# EAGLE design connectors (EAGLE 7.2.0)
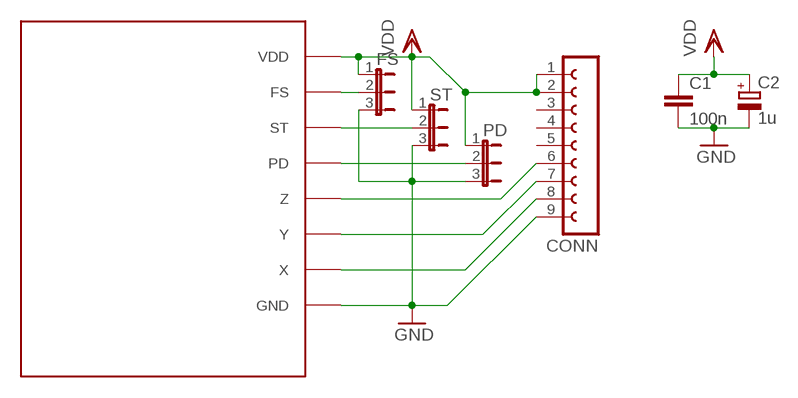
[diagram p0: schematic, sheet 1]

## Parts
C1  100n  C-EU050-025X075  [C050-025X075]
C2  1u  CPOL-EUE2-5  [E2-5]
CONN  FE09-1  [FE09]
FS  JP2E  [JP2]
PD  JP2E  [JP2]
ST  JP2E  [JP2]
U$2  LIS  [LIS344]

## Nets
GND: C1.2 C2.- CONN.9 FS.3 PD.3 ST.3 U$2.GND1(GND) U$2.GND2(GND) U$2.GND3(GND) U$2.GND5(GND)
N$1: CONN.8 U$2.X
N$2: FS.2 U$2.FS
N$3: CONN.7 U$2.Y
N$4: CONN.6 U$2.Z
N$5: ST.2 U$2.ST
N$6: PD.2 U$2.PD
VDD: C1.1 C2.+ CONN.1 CONN.2 FS.1 PD.1 ST.1 U$2.VDD U$2.VDD2(VDD)
Unconnected: CONN.3 CONN.4 CONN.5

## Library data of the parts
C1 = rcl:C-EU: CAPACITOR, European symbol
C2 = rcl:CPOL-EU: POLARIZED CAPACITOR, European symbol
CONN = con-lsta:FE09-1: FEMALE HEADER; OC_FARNELL: unknown; OC_NEWARK: unknown
FS PD ST = jumper:JP2E: JUMPER
U$2 = TIStellarisLaunchpad:LIS

## Net classes
2 power: width 0.508 mm, clearance 0.203 mm

## Board
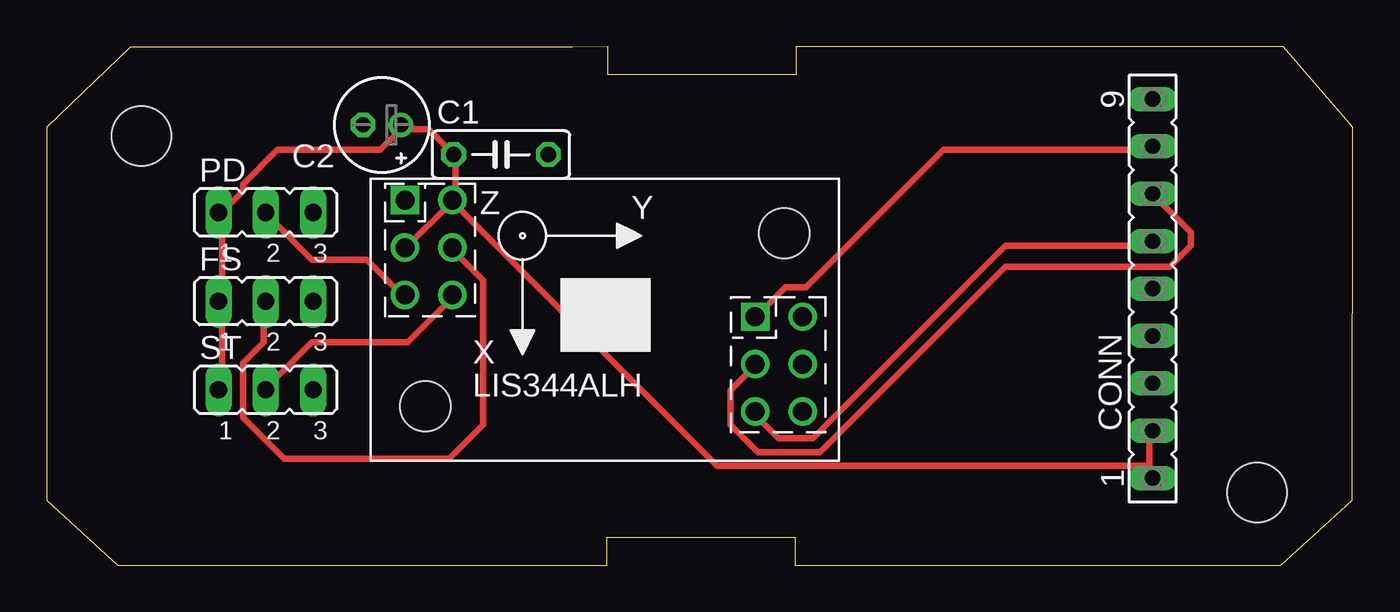
[diagram p1: board, top side]
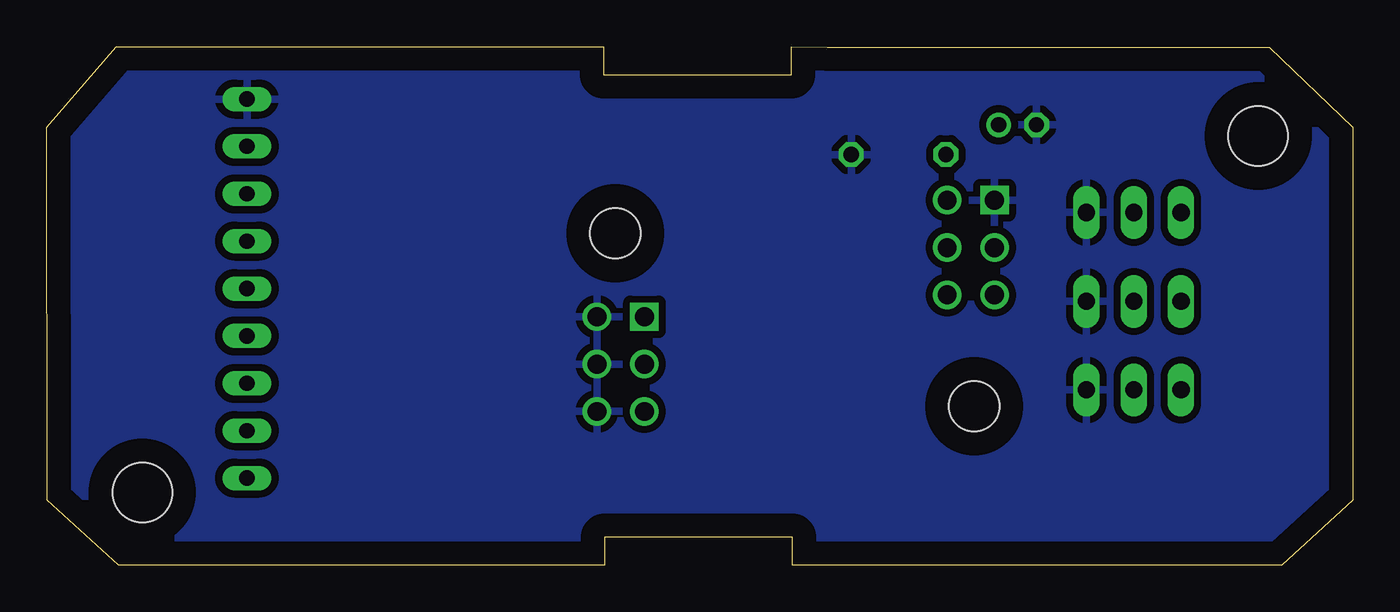
[diagram p2: board, bottom side, seen from below]

Size 70.05 x 27.8 mm. Coordinates in mm from the lower left corner, seen from the top.
Outline: 3.81,0 30.05,0 30.05,1.5 40.13,1.5 40.13,0 66.19,0 70.03,3.48 70.05,23.48 66.33,27.8 65.46,27.79 40.18,27.79 40.18,26.29 30.1,26.29 30.1,27.79 28.18,27.78 4.49,27.78 0,23.48 0,3.48 3.81,0
Copper layers (1*16): Top 0.035mm / dielectric 1.5mm / Bottom 0.035mm
Design rules "default *": minimum track width 14mil, minimum drill 24mil, track to track 15mil, track to pad 12mil, pad to pad 12mil, via to via 12mil, smd to smd 8mil, copper to edge 50mil, drill to drill 8mil, minimum pad ring 10mil, minimum via ring 8mil, stop-mask expansion 4mil, vias tented up to drill 0mil, thermal gap 15mil
Holes 3.2 mm at 5.08,23.01 64.92,3.91

### Footprints (pad centres in the part's own frame; a part is rotated, then mirrored left to right if it is on the bottom)
C050-025X075 = drill 0.813 octagon: 1 -2.54,0; 2 2.54,0
E2-5 = drill 0.813 pad 1.27: + -1.016,0 | drill 0.813 pad 1.27 octagon: - 1.016,0
FE09 = drill 0.813 long: 1 -10.16,0; 2 -7.62,0; 3 -5.08,0; 4 -2.54,0; 5 0,0; 6 2.54,0; 7 5.08,0; 8 7.62,0; 9 10.16,0
JP2 = drill 0.914 long: 1 -2.54,0; 2 0,0; 3 2.54,0
LIS344 = drill 1.016 pad 1.422: FS 4.37,11.43; GND2 23.15,7.72; GND3 23.15,5.18; GND5 23.15,2.64; PD 1.83,8.89; ST 4.37,8.89; VDD 4.37,13.97; VDD2 1.83,11.43; Y 20.61,5.18; Z 20.61,2.64 | drill 1.016 pad 1.422 square: GND1 1.83,13.97; X 20.61,7.72 | hole 2.7: 2.921,2.921; 22.169,12.192

### Placement (x,y rotation side)
C1  24.36,22.02 0 top
C2  17.98,23.61 180 top
CONN  59.31,14.83 90 top
FS  11.75,14.15 0 top
PD  11.75,18.91 0 top
ST  11.75,9.4 0 top
U$2  17.39,5.6 0 top

### Tracks (layer width: path | path; a pad name or v marks a point on that pad's centre or on a via)
GND
  pour Bottom (isolate 0.305): 0.3,27.84 70.1,27.84 70.46,-0.28 0.3,-0.28
N$1
  Top 0.356: CONN.8 59.14,22.28 48.09,22.28 40.73,14.91 39.62,14.91 38.15,13.44 U$2.X
N$2
  Top 0.356: FS.2 11.63,13.81 11.63,11.96 10.53,10.86 10.53,7.91 12.74,5.7 21.58,5.7 23.42,7.54 23.42,15.28 21.95,16.75 U$2.FS
N$3
  Top 0.356: CONN.7 59.51,19.7 61.35,17.86 61.35,17.12 60.25,16.01 51.41,16.01 41.47,6.07 38.15,6.07 36.68,7.54 36.68,9.39 37.78,10.49 U$2.Y
N$4
  Top 0.356: CONN.6 59.14,17.12 51.41,17.12 41.1,6.81 39.26,6.81 38.15,7.91 U$2.Z
N$5
  Top 0.356: ST.2 12,9.75 14.21,11.96 19.37,11.96 21.58,14.17 U$2.ST
N$6
  Top 0.356: PD.2 12,18.59 14.21,16.38 17.16,16.38 19,14.54 U$2.PD
VDD
  Top 0.356: ST.1 9.42,9.75 9.42,13.81 FS.1 9.42,14.17 9.42,18.59 PD.1 9.42,18.96 10.53,20.07 10.53,20.43 12.37,22.28 17.89,22.28 19,23.38 C2.+ 19.37,23.38 20.47,23.38 21.58,22.28 C1.1 21.95,21.91 21.95,19.7 U$2.VDD | 59.14,5.33 59.14,7.18 CONN.2 | 59.14,5.33 59.14,4.97 CONN.1 | U$2.VDD2 19.37,17.12 21.58,19.33 U$2.VDD | 59.14,5.33 35.94,5.33 21.95,19.33 U$2.VDD

### Text on the board
tValues: Dis | En